# EAGLE schematic SonicScrewdriver-R3 (EAGLE 6.5.0)
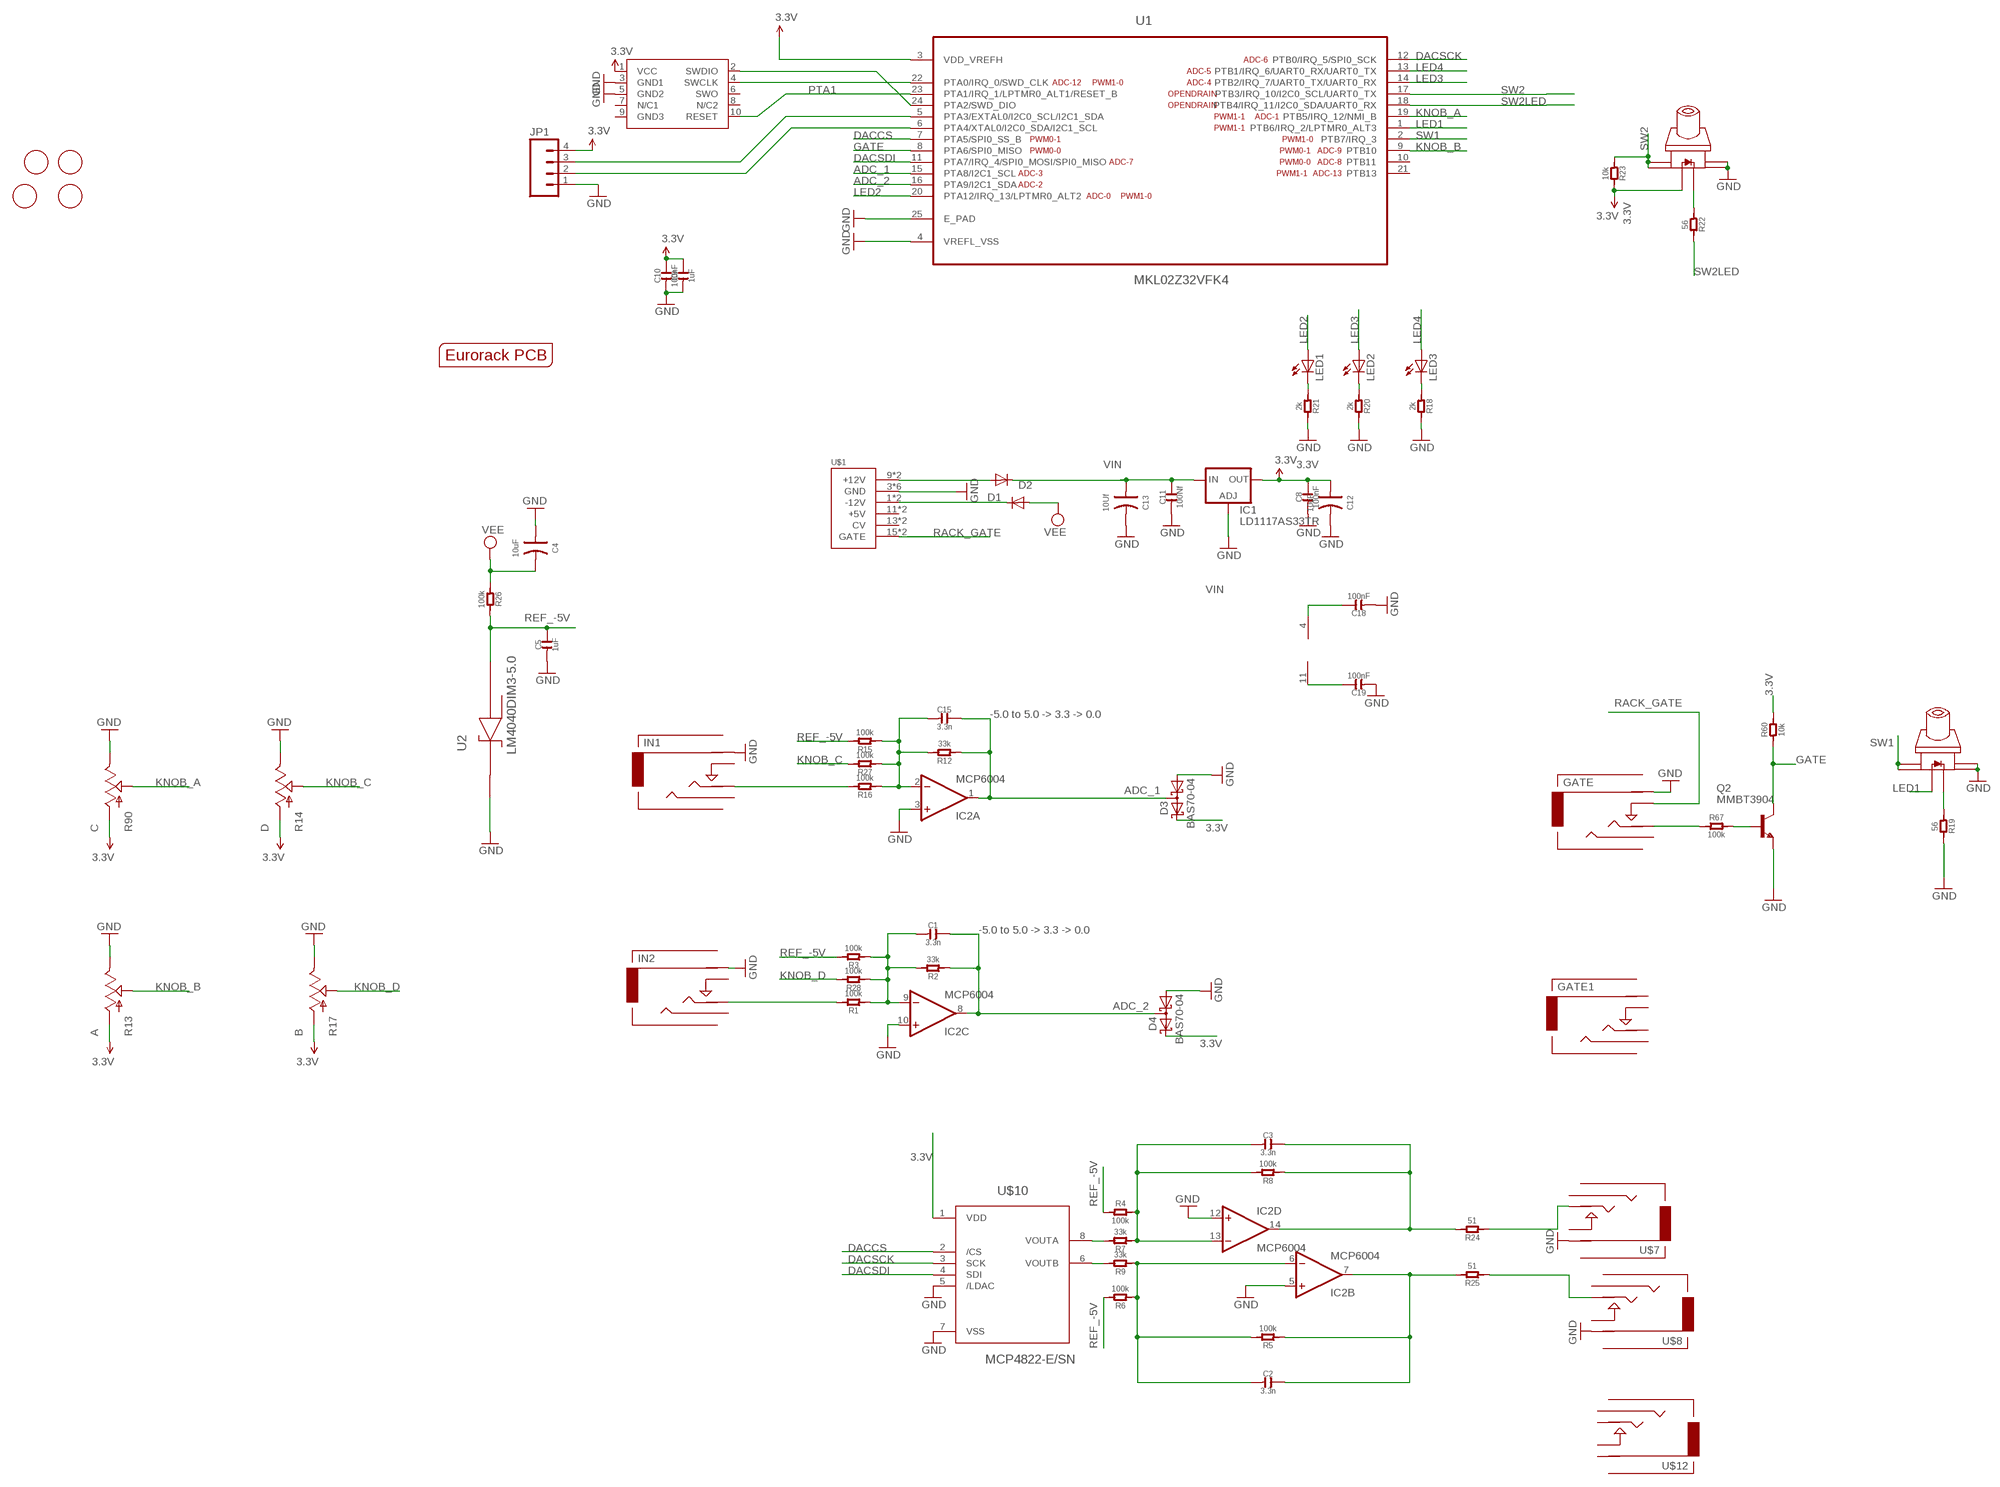
[diagram p0: schematic, sheet 1]

## Parts
C1  3.3n  C-0603  [C0603]
C2  3.3n  C-0603  [C0603]
C3  3.3n  C-0603  [C0603]
C4  10uF  C-POLAR-A  [AVX-A]
C5  1uF  C-0603  [C0603]
C8  100nF  C-0603  [C0603]
C9  1uF  C-0603  [C0603]
C10  100nF  C-0603  [C0603]
C11  100Nf  C-0603  [C0603]
C12  10uF  C-POLAR-A  [AVX-A]
C13  10Uf  C-POLAR-A  [AVX-A]
C15  3.3n  C-0603  [C0603]
C18  100nF  C-0603  [C0603]
C19  100nF  C-0603  [C0603]
D1  1N5819HW  DIODE-SOD123  [SOD123]
D2  1N5819HW  DIODE-SOD123  [SOD123]
D3  BAS70-04  [SOT23]
D4  BAS70-04  [SOT23]
GATE  Gate  AUDIO-JACKINPUT  [3.5MM-JACK-SWITCH-13MM-INPUT]
GATE1  Gate  AUDIO-JACKINPUT  [3.5MM-JACK-SWITCH-13MM-INPUT]
IC1  LD1117AS33TR  [SOT223]
IC2  MCP6004  TL074D  [SO14]
IN1  In 2  AUDIO-JACKINPUT  [3.5MM-JACK-SWITCH-13MM-INPUT]
IN2  In 1  AUDIO-JACKINPUT  [3.5MM-JACK-SWITCH-13MM-INPUT]
JP1  M04PTH  [1X04]
LED1  LED3MM  [LED3MM]
LED2  LED3MM  [LED3MM]
LED3  LED3MM  [LED3MM]
Q2  MMBT3904  MMBT3904LT1-NPN-SOT23-BEC  [SOT23-BEC]
R1  100k  R-0603  [R0603]
R2  33k  R-0603  [R0603]
R3  100k  R-0603  [R0603]
R4  100k  R-0603  [R0603]
R5  100k  R-0603  [R0603]
R6  100k  R-0603  [R0603]
R7  33k  R-0603  [R0603]
R8  100k  R-0603  [R0603]
R9  33k  R-0603  [R0603]
R12  33k  R-0603  [R0603]
R13  A  POTZEPHPOT  [OG-POTS_ALPS_POT_VERTICAL]
R14  D  POTZEPHPOT  [OG-POTS_ALPS_POT_VERTICAL]
R15  100k  R-0603  [R0603]
R16  100k  R-0603  [R0603]
R17  B  POTZEPHPOT  [OG-POTS_ALPS_POT_VERTICAL]
R18  2k  R-0603  [R0603]
R19  56  R-0603  [R0603]
R20  2k  R-0603  [R0603]
R21  2k  R-0603  [R0603]
R22  56  R-0603  [R0603]
R23  10k  R-0603  [R0603]
R24  51  R-0603  [R0603]
R25  51  R-0603  [R0603]
R26  100k  R-0603  [R0603]
R27  100k  R-0603  [R0603]
R28  100k  R-0603  [R0603]
R60  10k  R-0603  [R0603]
R67  100k  R-0603  [R0603]
R90  C  POTZEPHPOT  [OG-POTS_ALPS_POT_VERTICAL]
SWD1  CORTEX_SWD  [M50-3600542]
U1  MKL02Z32VFK4  [QFN50P400X400X100-25N]
U2  LM4040DIM3-5.0  [SOT95P237X112-3N]
U$1  POWER  [POWER_16]
U$2  EURORACK_PCB8HP  [EURORACK8HPPCB]
U$3  SWITCH_W_LED_PB6149L-X-102WHITE  [PB6149L]
U$4  FIDUCIAL  [FIDUCIAL_1MM]
U$5  FIDUCIAL  [FIDUCIAL_1MM]
U$6  SWITCH_W_LED_PB6149L-X-102WHITE  [PB6149L]
U$7  Out 2  AUDIO-JACKOUTPUT  [3.5MM-JACK-SWITCH-13MM-OUTPUT]
U$8  Out 1  AUDIO-JACKOUTPUT  [3.5MM-JACK-SWITCH-13MM-OUTPUT]
U$9  FIDUCIAL  [FIDUCIAL_1MM]
U$10  MCP4822-E/SN  [SOIC8-N_MC]
U$11  FIDUCIAL  [FIDUCIAL_1MM]
U$12  Out 1  AUDIO-JACKOUTPUT  [3.5MM-JACK-SWITCH-13MM-OUTPUT]

## Nets
3.3V: C8.2 C9.2 C10.2 C12.+ D3.2(C2) D4.2(C2) IC1.2(OUT) IC1.4(OUT) JP1.4 R13.P$3(A) R14.P$3(A) R17.P$3(A) R23.2 R60.2 R90.P$3(A) SWD1.1(VCC) U1.3(VDD_VREFH) U$3.LEDPOS(POS) U$10.1(VDD)
ADC_1: C15.2 D3.3(C1A2) IC2.1(A:OUT) R12.1 U1.15(PTA8/I2C1_SCL)
ADC_2: C1.2 D4.3(C1A2) IC2.8(C:OUT) R2.1 U1.16(PTA9/I2C1_SDA)
DACCS: U1.7(PTA5/SPI0_SS_B) U$10.2(/CS)
DACSCK: U1.12(PTB0/IRQ_5/SPI0_SCK) U$10.3(SCK)
DACSDI: U1.11(PTA7/IRQ_4/SPI0_MOSI/SPI0_MISO) U$10.4(SDI)
GATE: Q2.C R60.1 U1.8(PTA6/SPI0_MISO)
GND: C4.+ C5.1 C8.1 C9.1 C10.1 C11.1 C12.- C13.- C18.1 C19.1 D3.1(A1) D4.1(A1) GATE.RING@1(RING) GATE.RING@2(RING) IC1.1(ADJ) IC2.3(A:+IN) IC2.5(B:+IN) IC2.10(C:+IN) IC2.12(D:+IN) IN1.RING@1(RING) IN1.RING@2(RING) IN2.RING@1(RING) IN2.RING@2(RING) JP1.1 Q2.E R13.P$1(E) R14.P$1(E) R17.P$1(E) R18.2 R19.2 R20.2 R21.2 R90.P$1(E) SWD1.3(GND1) SWD1.5(GND2) U1.4(VREFL_VSS) U1.25(E_PAD) U2.1(CATHODE) U$1.3(GND) U$1.4(GND) U$1.5(GND) U$1.6(GND) U$1.7(GND) U$1.8(GND) U$3.3 U$3.4 U$6.3 U$6.4 U$7.RING@1(RING) U$7.RING@2(RING) U$8.RING@1(RING) U$8.RING@2(RING) U$10.5(/LDAC) U$10.7(VSS)
KNOB_A: R90.P$2(S) U1.19(PTB5/IRQ_12/NMI_B)
KNOB_B: R13.P$2(S) U1.9(PTB10)
KNOB_C: R14.P$2(S) R27.2
KNOB_D: R17.P$2(S) R28.2
LED1: U1.1(PTB6/IRQ_2/LPTMR0_ALT3) U$6.LEDPOS(POS)
LED2: LED1.A U1.20(PTA12/IRQ_13/LPTMR0_ALT2)
LED3: LED2.A U1.14(PTB2/IRQ_7/UART0_TX/UART0_RX)
LED4: LED3.A U1.13(PTB1/IRQ_6/UART0_RX/UART0_TX)
N$1: JP1.3 U1.5(PTA3/EXTAL0/I2C0_SCL/I2C1_SDA)
N$2: JP1.2 U1.6(PTA4/XTAL0/I2C0_SDA/I2C1_SCL)
N$3: IN1.TIP@1(TIP) IN1.TIP@2(TIP) R16.2
N$4: C15.1 IC2.2(A:-IN) R12.2 R15.1 R16.1 R27.1
N$5: SWD1.4(SWCLK) U1.22(PTA0/IRQ_0/SWD_CLK)
N$6: IN2.TIP@1(TIP) IN2.TIP@2(TIP) R1.2
N$7: SWD1.2(SWDIO) U1.24(PTA2/SWD_DIO)
N$8: C1.1 IC2.9(C:-IN) R1.1 R2.2 R3.1 R28.1
N$9: C2.1 IC2.6(B:-IN) R5.2 R6.1 R9.1
N$10: C3.1 IC2.13(D:-IN) R4.2 R7.1 R8.2
N$11: R7.2 U$10.8(VOUTA)
N$12: R9.2 U$10.6(VOUTB)
N$13: D1.A U$1.9(+12V) U$1.10(+12V)
N$14: R19.1 U$6.LEDNEG(NEG)
N$15: LED3.K(C) R18.1
N$16: LED2.K(C) R20.1
N$17: LED1.K(C) R21.1
N$18: C3.2 IC2.14(D:OUT) R8.1 R24.2
N$19: R22.1 U$3.LEDNEG(NEG)
N$20: R25.1 U$8.TIP@1(TIP) U$8.TIP@2(TIP)
N$21: R24.1 U$7.TIP@1(TIP) U$7.TIP@2(TIP)
N$24: C2.2 IC2.7(B:OUT) R5.1 R25.2
N$43: GATE.TIP@1(TIP) GATE.TIP@2(TIP) R67.1
N$64: D2.C U$1.1(-12V) U$1.2(-12V)
N$66: Q2.B R67.2
PTA1: SWD1.10(RESET) U1.23(PTA1/IRQ_1/LPTMR0_ALT1/RESET_B)
RACK_GATE: GATE.SWITCH@1(SWITCH) GATE.SWITCH@2(SWITCH) U$1.15(GATE) U$1.16(GATE)
REF_-5V: C5.2 R3.2 R4.1 R6.2 R15.2 R26.2 U2.2(ANODE)
SW1: U1.2(PTB7/IRQ_3) U$6.1 U$6.2
SW2: R23.1 U1.17(PTB3/IRQ_10/I2C0_SCL/UART0_TX) U$3.1 U$3.2
SW2LED: R22.2 U1.18(PTB4/IRQ_11/I2C0_SDA/UART0_RX)
VEE: C4.- C19.2 D2.A IC2.11(P:V-) R26.1
VIN: C11.2 C13.+ C18.2 D1.C IC1.3(IN) IC2.4(P:V+)
Unconnected: GATE1.RING@1(RING) GATE1.RING@2(RING) GATE1.SECOND@1(SECOND) GATE1.SECOND@2(SECOND) GATE1.SWITCH@1(SWITCH) GATE1.SWITCH@2(SWITCH) GATE1.TIP@1(TIP) GATE1.TIP@2(TIP) GATE.SECOND@1(SECOND) GATE.SECOND@2(SECOND) IN1.SECOND@1(SECOND) IN1.SECOND@2(SECOND) IN1.SWITCH@1(SWITCH) IN1.SWITCH@2(SWITCH) IN2.SECOND@1(SECOND) IN2.SECOND@2(SECOND) IN2.SWITCH@1(SWITCH) IN2.SWITCH@2(SWITCH) SWD1.6(SWO) SWD1.7(N/C1) SWD1.8(N/C2) SWD1.9(GND3) U1.10(PTB11) U1.21(PTB13) U2.3(NC) U$1.11(+5V) U$1.12(+5V) U$1.13(CV) U$1.14(CV) U$7.SECOND@1(SECOND) U$7.SECOND@2(SECOND) U$7.SWITCH@1(SWITCH) U$7.SWITCH@2(SWITCH) U$8.SECOND@1(SECOND) U$8.SECOND@2(SECOND) U$8.SWITCH@1(SWITCH) U$8.SWITCH@2(SWITCH) U$12.RING@1(RING) U$12.RING@2(RING) U$12.SECOND@1(SECOND) U$12.SECOND@2(SECOND) U$12.SWITCH@1(SWITCH) U$12.SWITCH@2(SWITCH) U$12.TIP@1(TIP) U$12.TIP@2(TIP)

## Notes on the sheet
- -5.0 to 5.0 -> 3.3 -> 0.0
- -5.0 to 5.0 -> 3.3 -> 0.0

## Library data of the parts
C1-C3 C5 C8-C11 C15 C18 C19 = OPL:C*
C4 C12 C13 = OPL:C-POLAR*
D1 D2 = diode:DIODE-: DIODE
D3 D4 = diode:BAS70-04: Silicon Schottky Diodes General-purpose diode for high-speed switching
GATE GATE1 IN1 IN2 U$7 U$8 U$12 = EurorackModularParts:AUDIO-JACK: Switching Mono 3.5mm Audio Jack from Erthenvar.
IC1 = ld-components:LD1117A?*: Low drop fixed and adjustable positive voltage regulators 1 A Source: http://www.st.com/stonline/products/literature/ds/7194/ld1117axx.pdf
IC2 = gm-ics:TL074: OP AMP
JP1 = SparkFun-Connectors:M04: Header 4 Standard 4-pin 0.1" header. Use with straight break away headers (SKU : PRT-00116), right angle break away headers (PRT-00553), swiss pins (PRT-00743), machine pins (PRT-00117), and female headers (PRT-00115). Molex polarized connector foot print use with SKU : PRT-08231 with associated crimp pins and housings. 1MM SMD Version SKU: PRT-10208
LED1-LED3 = SparkFun-LED:LED: LEDs Standard schematic elements and footprints for 5mm, 3mm, 1206, and 0603 sized LEDs. 5mm - Spark Fun Electronics SKU : COM-00529 (and others)
Q2 = transistor:*-NPN-: NPN Transistror BF959 corrected 2008.03.06
R1-R9 R12 R15 R16 R18-R28 R60 R67 = OPL:R*
R13 R14 R17 R90 = EurorackModularParts:POT
SWD1 = carrilib with jtags:CORTEX_SWD: .05" Cortex M Connector in SWD mode Manufacturer: Generic Part Number: Cortex M SWD Notes: I use Harwin M50-3600542 connectors
U1 = FarnellThings:MKL02Z32VFK4: IC, MCU, 32BIT, CORTEX M0+, 48MHZ, QFN-24; MPN: MKL02Z32VFK4; OC_FARNELL: 2321481; OC_NEWARK: 61W9887; PACKAGE: QFN-24; SUPPLIER: FREESCALE SEMICONDUCTOR
U2 = FarnellThings:LM4040DIM3-5.0: IC, Precision Micropower Shunt Voltage Reference, 5V,SOT-23-3; MPN: LM4040DIM3-5.0; OC_FARNELL: 9778330; OC_NEWARK: 97K3489; PACKAGE: SOT-23-3; SUPPLIER: TEXAS INSTRUMENTS
U$1 = eurorack:POWER
U$2 = EurorackModularParts:EURORACK_PCB
U$3 U$6 = zephod-components:SWITCH_W_LED_PB6149L-X-102
U$4 U$5 U$9 U$11 = adafruit:FIDUCIAL: For use by pick and place machines to calibrate the vision/machine, 1mm By microbuilder.eu
U$10 = FarnellThings:MCP4822-E/SN: 12 Bit DAC; DESCRIPTION: 12 Bit DAC; MPN: MCP4822-E/SN; OC_FARNELL: 1439414; OC_NEWARK: 31K2975; PACKAGE: SOIC-8; SUPPLIER: Microchip